# Altium schematic sheet Regulators.SchDoc
size Letter; CompanyName: Ploopy Corporation; Organization: Ploopy Corporation; Address1: 137-1140 Burnhamthorpe Road W; Address2: Mississauga; Address3: Ontario; Address4: Canada L5C 0A3; DocumentNumber: 7; Revision: R2.002; SheetNumber: 7; SheetTotal: 8
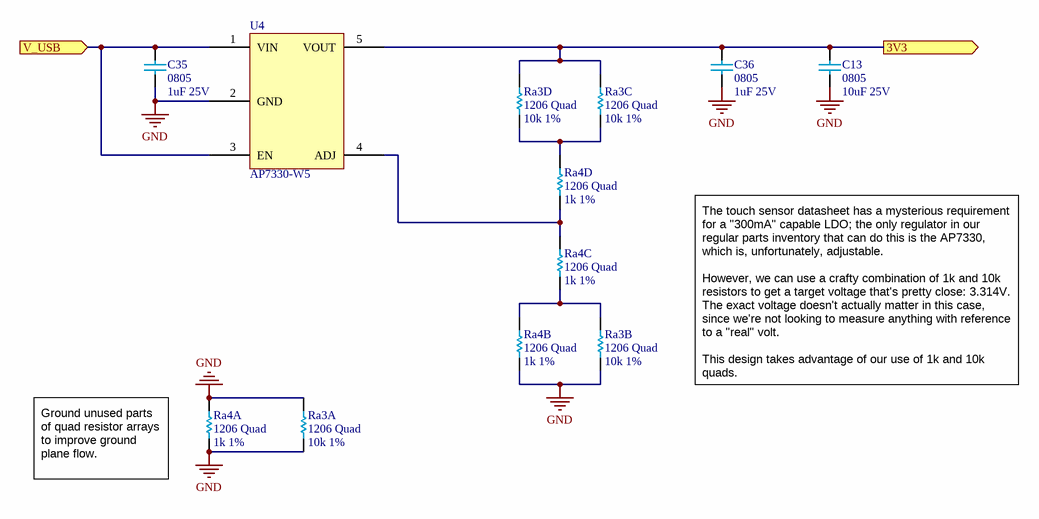
[diagram p0: Regulators.SchDoc]

## Parts
C13  0805  value 10uF 25V  [0805]
C35  0805  value 1uF 25V  [0805]
C36  0805  value 1uF 25V  [0805]
Ra3  1206 Quad  value 10k 1%  [4x 10k 1% - CAC-80P320X160-8M]  (parts A,B,C,D of 4)
Ra4  1206 Quad  value 1k 1%  [4x 1k 1% - CAC-80P320X160-8M]  (parts A,B,C,D of 4)
U4  AP7330-W5  [AP7330-W5 - SOT95P270X145-5N]

## Ports
3V3 (out), V_USB (in)

## Nets
GND: C13.1 C35.1 C36.1 Ra3.1 Ra3.2 Ra3.8 Ra4.1 Ra4.7 Ra4.8 U4.2(GND)
3V3: C13.2 C36.2 Ra3.3 Ra3.4 U4.5(VOUT) ; port 3V3
V_USB: C35.2 U4.1(VIN) U4.3(EN) ; port V_USB
NetRa3_5: Ra3.5 Ra3.6 Ra4.4
NetRa3_7: Ra3.7 Ra4.2 Ra4.3
NetRa4_5: Ra4.5 Ra4.6 U4.4(ADJ)

## Notes on the sheet
- The touch sensor datasheet has a mysterious requirement for a "300mA" capable LDO; the only regulator in our regular parts inventory that can do this is the AP7330, which is, unfortunately, adjustable.
  However, we can use a crafty combination of 1k and 10k resistors to get a target voltage that's pretty close: 3.314V. The exact voltage doesn't actually matter in this case, since we're not looking to measure anything with reference to a "real" volt.
  This design takes advantage of our use of 1k and 10k quads.
- (near Ra4) Ground unused parts of quad resistor arrays to improve ground plane flow.
- Copyright Ploopy Corporation 2024
- Licensed under the CERN-OHL-S v2
- http://ohwr.org/cernohl
- Title:
- PCB:
- Version:
- Ploopy Corporation
- Mississauga ON L5C 0A3
- 137-1140 Burnhamthorpe Road W
- Date:
- Time:
- Sheet
- of
- Canada

## Library data of the parts
C13 = Cap 10uF 25V: 0805, X5R or better; PNP-Nzl: 2; PNP-dx: 0; PNP-X: 2.00; PNP-Y: 1.25; PNP-Lv: 1; PNP-TS: 70; PNP-Type: chi; PNP-FeedType: Tape; PNP-TapeWidth: 8; PNP-dy: 0; PNP-Pt: 0; PNP-W: 0; PNP-Thk: 1.25; PNP-Level: 1; PNP-Voff: 0; PNP-PlacePriority: 1; PNP-A: 0; PNP-TapeIndex: 1; Supplier 1: Mouser; Supplier Part Number 1: 81-GRM21BR61E106KA3L; Supplier 2: Digi-Key; Supplier Part Number 2: 490-5523-1-ND; PNP-da: 0
C35 C36 = Cap 1uF 25V: 0805, X5R or better; PNP-Nzl: 2; PNP-dx: 0; PNP-Level: 1; PNP-Thk: 1.25; PNP-TS: 70; PNP-Type: chi; PNP-X: 2.00; PNP-FeedType: Tape; PNP-TapeWidth: 8; Supplier 1: Digi-Key; Supplier Part Number 1: 1276-1066-2-ND; Supplier 2: Digi-Key; Supplier Part Number 2: 1276-1066-1-ND; PNP-dy: 0; PNP-Lv: 1; PNP-Pt: 0; PNP-Voff: 0; PNP-W: 0; PNP-Y: 1.25; PNP-A: 0; PNP-PlacePriority: 1; PNP-TapeIndex: 1; PNP-da: 0
Ra3 = Quad Res 10k 1% 1206: Chip resistor
Ra4 = Quad Res 1k 1% 1206: Chip resistor
U4 = AP7330-W5: 300mA HIGH PSRR LOW NOISE LDO WITH ENABLE; Supplier 1: Digi-Key; Supplier Part Number 1: AP2202K-ADJTRG1DICT-ND; Supplier 2: Digi-Key; Supplier Part Number 2: 576-1262-1-ND